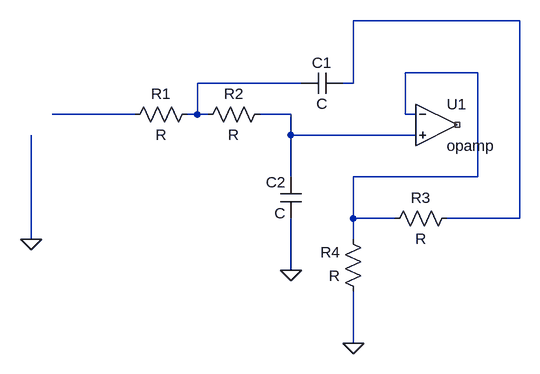
[diagram p0: schematic low pass.asc]
low pass.asc, the LTspice schematic file:
Version 4
SHEET 1 880 680
WIRE 432 -48 176 -48
WIRE 368 32 256 32
WIRE 96 48 -64 48
WIRE 176 48 176 -48
WIRE 176 48 160 48
WIRE -160 96 -288 96
WIRE -64 96 -64 48
WIRE -64 96 -80 96
WIRE -48 96 -64 96
WIRE 80 96 32 96
WIRE 256 96 256 32
WIRE 272 96 256 96
WIRE 80 128 80 96
WIRE 272 128 80 128
WIRE 80 192 80 128
WIRE 368 192 368 32
WIRE 368 192 176 192
WIRE 176 256 176 192
WIRE 240 256 176 256
WIRE 432 256 432 -48
WIRE 432 256 320 256
WIRE -320 288 -320 128
WIRE 176 288 176 256
WIRE 80 336 80 256
WIRE 176 448 176 368
FLAG 80 336 0
FLAG 176 448 0
FLAG -320 288 0
SYMBOL OpAmps\\opamp 304 48 R0
SYMATTR InstName U1
SYMBOL res -64 80 R90
WINDOW 0 0 56 VBottom 2
WINDOW 3 32 56 VTop 2
SYMATTR InstName R1
SYMBOL res 48 80 R90
WINDOW 0 0 56 VBottom 2
WINDOW 3 32 56 VTop 2
SYMATTR InstName R2
SYMBOL res 336 240 R90
WINDOW 0 0 56 VBottom 2
WINDOW 3 32 56 VTop 2
SYMATTR InstName R3
SYMBOL res 192 384 R180
WINDOW 0 36 76 Left 2
WINDOW 3 36 40 Left 2
SYMATTR InstName R4
SYMBOL cap 160 32 R90
WINDOW 0 0 32 VBottom 2
WINDOW 3 32 32 VTop 2
SYMATTR InstName C1
SYMBOL cap 96 256 R180
WINDOW 0 24 56 Left 2
WINDOW 3 24 8 Left 2
SYMATTR InstName C2

The netlist it stands for:
* low pass.asc
XU1 N002 N005 NC_01 opamp Aol=100K GBW=10Meg  ; pins invin noninvin out
R1 N003 N004 R
R2 N005 N003 R
R3 N001 N002 R
R4 0 N002 R
C1 N001 N003 C
C2 0 N005 C
.backanno
.end